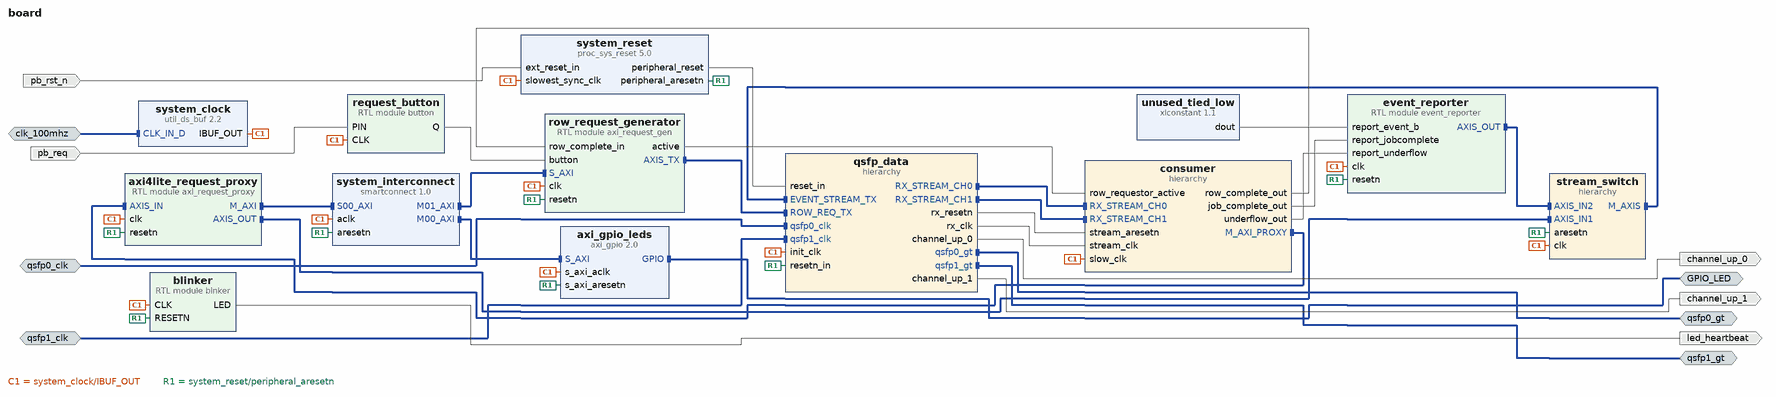
[diagram p0: block diagram of the top level]
# Vivado block design board, xczu19eg-ffvc1760-2-i, Vivado 2021.1
create_bd_design board

create_bd_intf_port -mode Slave -vlnv xilinx.com:interface:diff_clock_rtl:1.0 clk_100mhz
create_bd_intf_port -mode Slave -vlnv xilinx.com:interface:diff_clock_rtl:1.0 qsfp1_clk
set_property -dict {CONFIG.FREQ_HZ 322265625} [get_bd_intf_ports qsfp1_clk]
create_bd_intf_port -mode Slave -vlnv xilinx.com:interface:diff_clock_rtl:1.0 qsfp0_clk
set_property -dict {CONFIG.FREQ_HZ 322265625} [get_bd_intf_ports qsfp0_clk]
create_bd_intf_port -mode Master -vlnv xilinx.com:interface:gpio_rtl:1.0 GPIO_LED
create_bd_intf_port -mode Master -vlnv xilinx.com:interface:gt_rtl:1.0 qsfp0_gt
create_bd_intf_port -mode Master -vlnv xilinx.com:interface:gt_rtl:1.0 qsfp1_gt
create_bd_port -dir O led_heartbeat
create_bd_port -dir I -type rst pb_rst_n
create_bd_port -dir I pb_req
create_bd_port -dir O channel_up_1
create_bd_port -dir O channel_up_0

create_bd_cell -type ip -vlnv xilinx.com:ip:util_ds_buf:2.2 system_clock
create_bd_cell -type ip -vlnv xilinx.com:ip:proc_sys_reset:5.0 system_reset
set_property -dict {CONFIG.C_AUX_RESET_HIGH 0} [get_bd_cells system_reset]
create_bd_cell -type module -reference binker blinker
create_bd_cell -type hier qsfp_data
create_bd_cell -type module -reference button request_button
set_property -dict {CONFIG.ACTIVE_STATE 0 CONFIG.CLOCKS_PER_USEC 400} [get_bd_cells request_button]
create_bd_cell -type hier consumer
create_bd_cell -type ip -vlnv xilinx.com:ip:axi_gpio:2.0 axi_gpio_leds
set_property -dict {CONFIG.C_ALL_OUTPUTS 1 CONFIG.C_GPIO_WIDTH 4} [get_bd_cells axi_gpio_leds]
create_bd_cell -type ip -vlnv xilinx.com:ip:smartconnect:1.0 system_interconnect
set_property -dict {CONFIG.NUM_MI 3 CONFIG.NUM_SI 1} [get_bd_cells system_interconnect]
create_bd_cell -type hier stream_switch
create_bd_cell -type ip -vlnv xilinx.com:ip:xlconstant:1.1 unused_tied_low
set_property -dict {CONFIG.CONST_VAL 0} [get_bd_cells unused_tied_low]
create_bd_cell -type module -reference event_reporter event_reporter
create_bd_cell -type module -reference axi_request_gen row_request_generator
create_bd_cell -type module -reference axi_request_proxy axi4lite_request_proxy

# ---- hierarchy /qsfp_data ----
current_bd_instance /qsfp_data
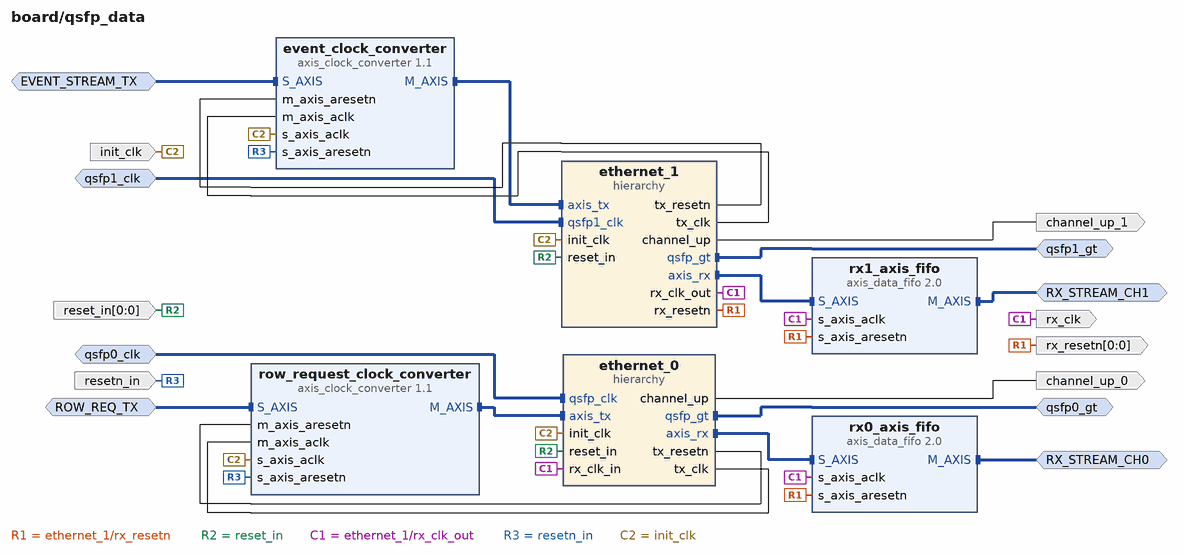
[diagram p1: block diagram inside /qsfp_data]
create_bd_intf_pin -mode Slave -vlnv xilinx.com:interface:axis_rtl:1.0 ROW_REQ_TX
create_bd_intf_pin -mode Slave -vlnv xilinx.com:interface:diff_clock_rtl:1.0 qsfp0_clk
create_bd_intf_pin -mode Slave -vlnv xilinx.com:interface:diff_clock_rtl:1.0 qsfp1_clk
create_bd_intf_pin -mode Slave -vlnv xilinx.com:interface:axis_rtl:1.0 EVENT_STREAM_TX
create_bd_intf_pin -mode Master -vlnv xilinx.com:interface:gt_rtl:1.0 qsfp0_gt
create_bd_intf_pin -mode Master -vlnv xilinx.com:interface:gt_rtl:1.0 qsfp1_gt
create_bd_intf_pin -mode Master -vlnv xilinx.com:interface:axis_rtl:1.0 RX_STREAM_CH0
create_bd_intf_pin -mode Master -vlnv xilinx.com:interface:axis_rtl:1.0 RX_STREAM_CH1
create_bd_pin -dir O channel_up_0
create_bd_pin -dir I -type clk init_clk
create_bd_pin -dir O -type clk rx_clk
create_bd_pin -dir O -from 0 -to 0 rx_resetn
create_bd_pin -dir O channel_up_1
create_bd_pin -dir I resetn_in
create_bd_pin -dir I -from 0 -to 0 reset_in

create_bd_cell -type ip -vlnv xilinx.com:ip:axis_data_fifo:2.0 rx0_axis_fifo
create_bd_cell -type ip -vlnv xilinx.com:ip:axis_data_fifo:2.0 rx1_axis_fifo
set_property -dict {CONFIG.IS_ACLK_ASYNC 0} [get_bd_cells rx1_axis_fifo]
create_bd_cell -type ip -vlnv xilinx.com:ip:axis_clock_converter:1.1 event_clock_converter
create_bd_cell -type ip -vlnv xilinx.com:ip:axis_clock_converter:1.1 row_request_clock_converter
create_bd_cell -type hier ethernet_1
create_bd_cell -type hier ethernet_0

# ---- hierarchy /qsfp_data/ethernet_1 ----
current_bd_instance /qsfp_data/ethernet_1
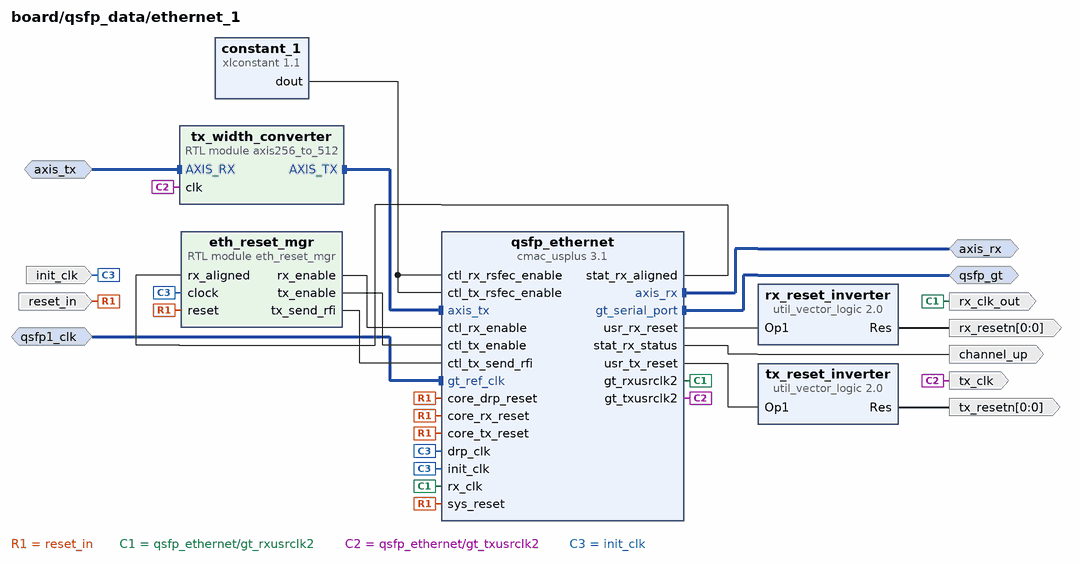
[diagram p2: block diagram inside /qsfp_data/ethernet_1]
create_bd_intf_pin -mode Master -vlnv xilinx.com:interface:gt_rtl:1.0 qsfp_gt
create_bd_intf_pin -mode Slave -vlnv xilinx.com:interface:diff_clock_rtl:1.0 qsfp1_clk
create_bd_intf_pin -mode Master -vlnv xilinx.com:interface:axis_rtl:1.0 axis_rx
create_bd_intf_pin -mode Slave -vlnv xilinx.com:interface:axis_rtl:1.0 axis_tx
create_bd_pin -dir O -type clk tx_clk
create_bd_pin -dir I reset_in
create_bd_pin -dir I -type clk init_clk
create_bd_pin -dir O -type clk rx_clk_out
create_bd_pin -dir O channel_up
create_bd_pin -dir O -from 0 -to 0 rx_resetn
create_bd_pin -dir O -from 0 -to 0 tx_resetn

create_bd_cell -type ip -vlnv xilinx.com:ip:cmac_usplus:3.1 qsfp_ethernet
set_property -dict [list \
  CONFIG.CMAC_CAUI4_MODE 1 \
  CONFIG.CMAC_CORE_SELECT CMACE4_X0Y2 \
  CONFIG.ENABLE_AXI_INTERFACE 0 \
  CONFIG.GT_GROUP_SELECT {X0Y16~X0Y19} \
  CONFIG.GT_REF_CLK_FREQ 322.265625 \
  CONFIG.INCLUDE_RS_FEC 1 \
  CONFIG.INS_LOSS_NYQ 20 \
  CONFIG.NUM_LANES 4x25 \
  CONFIG.RX_FLOW_CONTROL 0 \
  CONFIG.TX_FLOW_CONTROL 0 \
  CONFIG.USER_INTERFACE AXIS \
] [get_bd_cells qsfp_ethernet]
create_bd_cell -type ip -vlnv xilinx.com:ip:util_vector_logic:2.0 rx_reset_inverter
set_property -dict {CONFIG.C_OPERATION not CONFIG.C_SIZE 1} [get_bd_cells rx_reset_inverter]
create_bd_cell -type module -reference axis256_to_512 tx_width_converter
create_bd_cell -type module -reference eth_reset_mgr eth_reset_mgr
create_bd_cell -type ip -vlnv xilinx.com:ip:util_vector_logic:2.0 tx_reset_inverter
set_property -dict {CONFIG.C_OPERATION not CONFIG.C_SIZE 1} [get_bd_cells tx_reset_inverter]
create_bd_cell -type ip -vlnv xilinx.com:ip:xlconstant:1.1 constant_1

# ---- hierarchy /qsfp_data/ethernet_0 ----
current_bd_instance /qsfp_data/ethernet_0
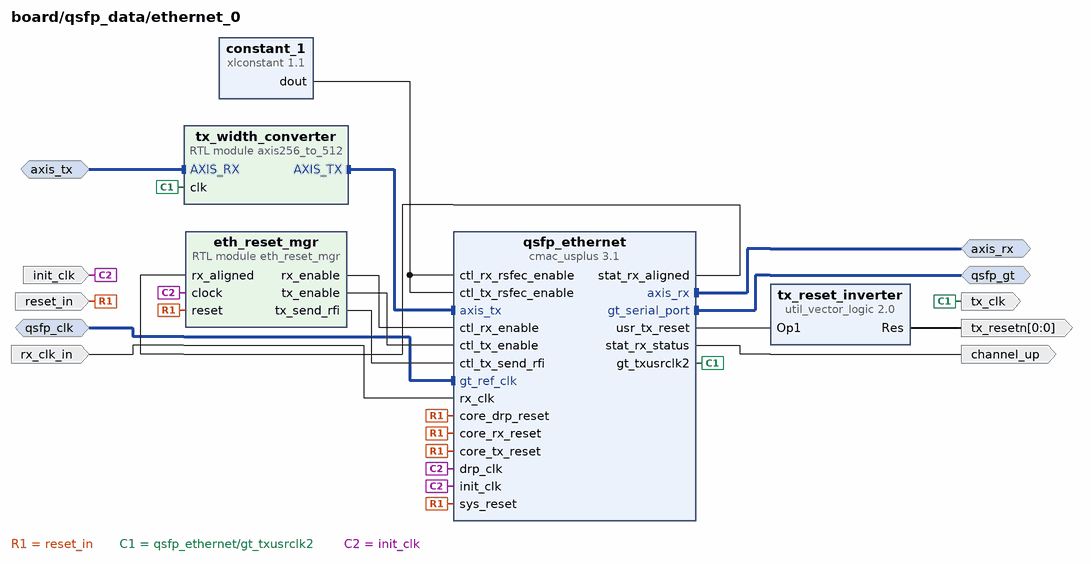
[diagram p3: block diagram inside /qsfp_data/ethernet_0]
create_bd_intf_pin -mode Master -vlnv xilinx.com:interface:gt_rtl:1.0 qsfp_gt
create_bd_intf_pin -mode Slave -vlnv xilinx.com:interface:diff_clock_rtl:1.0 qsfp_clk
create_bd_intf_pin -mode Master -vlnv xilinx.com:interface:axis_rtl:1.0 axis_rx
create_bd_intf_pin -mode Slave -vlnv xilinx.com:interface:axis_rtl:1.0 axis_tx
create_bd_pin -dir O -type clk tx_clk
create_bd_pin -dir I reset_in
create_bd_pin -dir I -type clk init_clk
create_bd_pin -dir O channel_up
create_bd_pin -dir O -from 0 -to 0 tx_resetn
create_bd_pin -dir I -type clk rx_clk_in

create_bd_cell -type ip -vlnv xilinx.com:ip:cmac_usplus:3.1 qsfp_ethernet
set_property -dict [list \
  CONFIG.CMAC_CAUI4_MODE 1 \
  CONFIG.CMAC_CORE_SELECT CMACE4_X0Y1 \
  CONFIG.GT_GROUP_SELECT {X0Y12~X0Y15} \
  CONFIG.GT_REF_CLK_FREQ 322.265625 \
  CONFIG.INCLUDE_RS_FEC 1 \
  CONFIG.INS_LOSS_NYQ 20 \
  CONFIG.NUM_LANES 4x25 \
  CONFIG.RX_FLOW_CONTROL 0 \
  CONFIG.TX_FLOW_CONTROL 0 \
  CONFIG.USER_INTERFACE AXIS \
] [get_bd_cells qsfp_ethernet]
create_bd_cell -type module -reference axis256_to_512 tx_width_converter
create_bd_cell -type module -reference eth_reset_mgr eth_reset_mgr
create_bd_cell -type ip -vlnv xilinx.com:ip:util_vector_logic:2.0 tx_reset_inverter
set_property -dict {CONFIG.C_OPERATION not CONFIG.C_SIZE 1} [get_bd_cells tx_reset_inverter]
create_bd_cell -type ip -vlnv xilinx.com:ip:xlconstant:1.1 constant_1

# ---- hierarchy /consumer ----
current_bd_instance /consumer
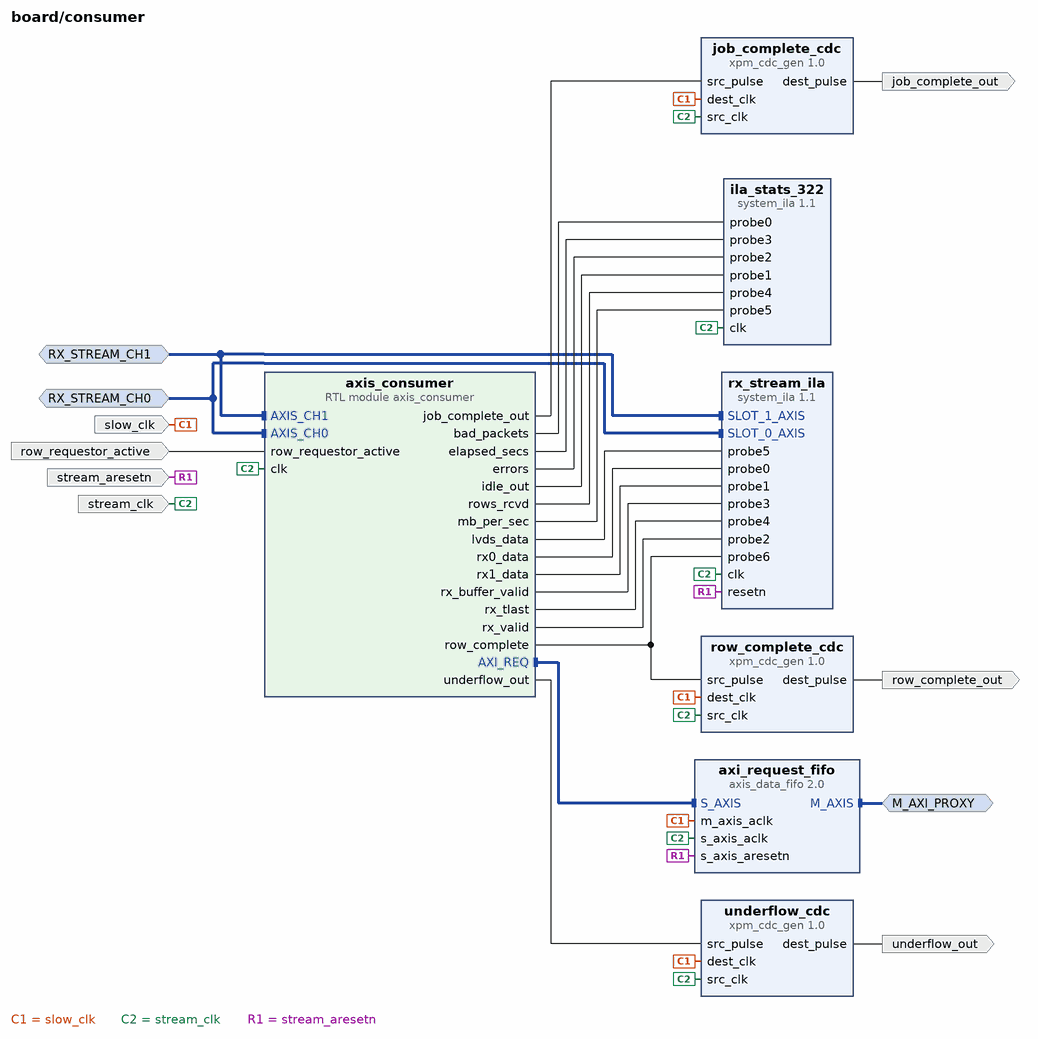
[diagram p4: block diagram inside /consumer]
create_bd_intf_pin -mode Master -vlnv xilinx.com:interface:axis_rtl:1.0 M_AXI_PROXY
create_bd_intf_pin -mode Slave -vlnv xilinx.com:interface:axis_rtl:1.0 RX_STREAM_CH0
create_bd_intf_pin -mode Slave -vlnv xilinx.com:interface:axis_rtl:1.0 RX_STREAM_CH1
create_bd_pin -dir I -type clk stream_clk
create_bd_pin -dir I -type clk slow_clk
create_bd_pin -dir O row_complete_out
create_bd_pin -dir I -type rst stream_aresetn
create_bd_pin -dir I row_requestor_active
create_bd_pin -dir O underflow_out
create_bd_pin -dir O job_complete_out

create_bd_cell -type ip -vlnv xilinx.com:ip:xpm_cdc_gen:1.0 row_complete_cdc
set_property -dict [list \
  CONFIG.CDC_TYPE xpm_cdc_pulse \
  CONFIG.RST_USED false \
  CONFIG.SIM_ASSERT_CHK false \
] [get_bd_cells row_complete_cdc]
create_bd_cell -type ip -vlnv xilinx.com:ip:axis_data_fifo:2.0 axi_request_fifo
set_property -dict {CONFIG.FIFO_DEPTH 16 CONFIG.IS_ACLK_ASYNC 1} [get_bd_cells axi_request_fifo]
create_bd_cell -type ip -vlnv xilinx.com:ip:xpm_cdc_gen:1.0 underflow_cdc
set_property -dict {CONFIG.CDC_TYPE xpm_cdc_pulse CONFIG.RST_USED false CONFIG.SIM_ASSERT_CHK false} [get_bd_cells underflow_cdc]
create_bd_cell -type ip -vlnv xilinx.com:ip:xpm_cdc_gen:1.0 job_complete_cdc
set_property -dict [list \
  CONFIG.CDC_TYPE xpm_cdc_pulse \
  CONFIG.RST_USED false \
  CONFIG.SIM_ASSERT_CHK false \
] [get_bd_cells job_complete_cdc]
create_bd_cell -type ip -vlnv xilinx.com:ip:system_ila:1.1 rx_stream_ila
set_property -dict [list \
  CONFIG.C_MON_TYPE MIX \
  CONFIG.C_NUM_MONITOR_SLOTS 2 \
  CONFIG.C_NUM_OF_PROBES 7 \
  CONFIG.C_SLOT 1 \
  CONFIG.C_SLOT_0_INTF_TYPE xilinx.com:interface:axis_rtl:1.0 \
  CONFIG.C_SLOT_1_INTF_TYPE xilinx.com:interface:axis_rtl:1.0 \
] [get_bd_cells rx_stream_ila]
create_bd_cell -type ip -vlnv xilinx.com:ip:system_ila:1.1 ila_stats_322
set_property -dict {CONFIG.C_MON_TYPE NATIVE CONFIG.C_NUM_OF_PROBES 6} [get_bd_cells ila_stats_322]
create_bd_cell -type module -reference axis_consumer axis_consumer

# ---- hierarchy /stream_switch ----
current_bd_instance /stream_switch
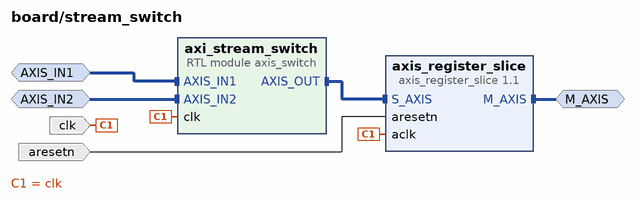
[diagram p5: block diagram inside /stream_switch]
create_bd_intf_pin -mode Slave -vlnv xilinx.com:interface:axis_rtl:1.0 AXIS_IN1
create_bd_intf_pin -mode Slave -vlnv xilinx.com:interface:axis_rtl:1.0 AXIS_IN2
create_bd_intf_pin -mode Master -vlnv xilinx.com:interface:axis_rtl:1.0 M_AXIS
create_bd_pin -dir I -type clk clk
create_bd_pin -dir I -type rst aresetn

create_bd_cell -type module -reference axis_switch axi_stream_switch
create_bd_cell -type ip -vlnv xilinx.com:ip:axis_register_slice:1.1 axis_register_slice

# ---- connections ----

current_bd_instance /qsfp_data
connect_bd_intf_net [get_bd_intf_pins qsfp1_gt] [get_bd_intf_pins ethernet_1/qsfp_gt]
connect_bd_intf_net [get_bd_intf_pins qsfp0_gt] [get_bd_intf_pins ethernet_0/qsfp_gt]
connect_bd_intf_net [get_bd_intf_pins EVENT_STREAM_TX] [get_bd_intf_pins event_clock_converter/S_AXIS]
connect_bd_intf_net [get_bd_intf_pins ROW_REQ_TX] [get_bd_intf_pins row_request_clock_converter/S_AXIS]
connect_bd_intf_net [get_bd_intf_pins event_clock_converter/M_AXIS] [get_bd_intf_pins ethernet_1/axis_tx]
connect_bd_intf_net [get_bd_intf_pins qsfp0_clk] [get_bd_intf_pins ethernet_0/qsfp_clk]
connect_bd_intf_net [get_bd_intf_pins ethernet_0/axis_rx] [get_bd_intf_pins rx0_axis_fifo/S_AXIS]
connect_bd_intf_net [get_bd_intf_pins qsfp1_clk] [get_bd_intf_pins ethernet_1/qsfp1_clk]
connect_bd_intf_net [get_bd_intf_pins rx1_axis_fifo/S_AXIS] [get_bd_intf_pins ethernet_1/axis_rx]
connect_bd_intf_net [get_bd_intf_pins row_request_clock_converter/M_AXIS] [get_bd_intf_pins ethernet_0/axis_tx]
connect_bd_intf_net [get_bd_intf_pins RX_STREAM_CH0] [get_bd_intf_pins rx0_axis_fifo/M_AXIS]
connect_bd_intf_net [get_bd_intf_pins RX_STREAM_CH1] [get_bd_intf_pins rx1_axis_fifo/M_AXIS]
connect_bd_net -net ethernet_0_Res [get_bd_pins ethernet_0/tx_resetn] [get_bd_pins row_request_clock_converter/m_axis_aresetn]
connect_bd_net -net ethernet_1_Res [get_bd_pins ethernet_1/rx_resetn] \
  [get_bd_pins rx1_axis_fifo/s_axis_aresetn] [get_bd_pins rx0_axis_fifo/s_axis_aresetn] [get_bd_pins rx_resetn]
connect_bd_net -net ethernet_1_Res1 [get_bd_pins ethernet_1/tx_resetn] [get_bd_pins event_clock_converter/m_axis_aresetn]
connect_bd_net -net master_reset_Res [get_bd_pins reset_in] [get_bd_pins ethernet_1/reset_in] [get_bd_pins ethernet_0/reset_in]
connect_bd_net -net qsfp0_ethernet_gt_txusrclk2 [get_bd_pins ethernet_0/tx_clk] [get_bd_pins row_request_clock_converter/m_axis_aclk]
connect_bd_net -net qsfp0_ethernet_stat_rx_status [get_bd_pins ethernet_0/channel_up] [get_bd_pins channel_up_0]
connect_bd_net -net qsfp1_ethernet_gt_rxusrclk2 [get_bd_pins ethernet_1/rx_clk_out] \
  [get_bd_pins rx1_axis_fifo/s_axis_aclk] [get_bd_pins ethernet_0/rx_clk_in] [get_bd_pins rx_clk] \
  [get_bd_pins rx0_axis_fifo/s_axis_aclk]
connect_bd_net -net qsfp1_ethernet_gt_txusrclk2 [get_bd_pins ethernet_1/tx_clk] [get_bd_pins event_clock_converter/m_axis_aclk]
connect_bd_net -net qsfp1_ethernet_stat_rx_status [get_bd_pins ethernet_1/channel_up] [get_bd_pins channel_up_1]
connect_bd_net [get_bd_pins resetn_in] [get_bd_pins event_clock_converter/s_axis_aresetn] [get_bd_pins row_request_clock_converter/s_axis_aresetn]
connect_bd_net -net system_clock_IBUF_OUT [get_bd_pins init_clk] \
  [get_bd_pins event_clock_converter/s_axis_aclk] [get_bd_pins row_request_clock_converter/s_axis_aclk] \
  [get_bd_pins ethernet_1/init_clk] [get_bd_pins ethernet_0/init_clk]

current_bd_instance /qsfp_data/ethernet_1
connect_bd_intf_net [get_bd_intf_pins qsfp_gt] [get_bd_intf_pins qsfp_ethernet/gt_serial_port]
connect_bd_intf_net [get_bd_intf_pins axis_tx] [get_bd_intf_pins tx_width_converter/AXIS_RX]
connect_bd_intf_net [get_bd_intf_pins qsfp1_clk] [get_bd_intf_pins qsfp_ethernet/gt_ref_clk]
connect_bd_intf_net [get_bd_intf_pins axis_rx] [get_bd_intf_pins qsfp_ethernet/axis_rx]
connect_bd_intf_net [get_bd_intf_pins qsfp_ethernet/axis_tx] [get_bd_intf_pins tx_width_converter/AXIS_TX]
connect_bd_net [get_bd_pins constant_1/dout] [get_bd_pins qsfp_ethernet/ctl_rx_rsfec_enable] [get_bd_pins qsfp_ethernet/ctl_tx_rsfec_enable]
connect_bd_net -net eth_reset_mgr_0_rx_enable [get_bd_pins eth_reset_mgr/rx_enable] [get_bd_pins qsfp_ethernet/ctl_rx_enable]
connect_bd_net -net eth_reset_mgr_0_tx_enable [get_bd_pins eth_reset_mgr/tx_enable] [get_bd_pins qsfp_ethernet/ctl_tx_enable]
connect_bd_net -net eth_reset_mgr_0_tx_send_rfi [get_bd_pins eth_reset_mgr/tx_send_rfi] [get_bd_pins qsfp_ethernet/ctl_tx_send_rfi]
connect_bd_net -net master_reset_Res [get_bd_pins reset_in] \
  [get_bd_pins qsfp_ethernet/core_rx_reset] [get_bd_pins qsfp_ethernet/core_tx_reset] \
  [get_bd_pins qsfp_ethernet/core_drp_reset] [get_bd_pins qsfp_ethernet/sys_reset] [get_bd_pins eth_reset_mgr/reset]
connect_bd_net -net qsfp1_ethernet_gt_rxusrclk2 [get_bd_pins qsfp_ethernet/gt_rxusrclk2] [get_bd_pins rx_clk_out] [get_bd_pins qsfp_ethernet/rx_clk]
connect_bd_net -net qsfp1_ethernet_gt_txusrclk2 [get_bd_pins qsfp_ethernet/gt_txusrclk2] [get_bd_pins tx_clk] [get_bd_pins tx_width_converter/clk]
connect_bd_net -net qsfp1_ethernet_stat_rx_aligned [get_bd_pins qsfp_ethernet/stat_rx_aligned] [get_bd_pins eth_reset_mgr/rx_aligned]
connect_bd_net -net qsfp1_ethernet_stat_rx_status [get_bd_pins qsfp_ethernet/stat_rx_status] [get_bd_pins channel_up]
connect_bd_net -net qsfp1_ethernet_usr_rx_reset [get_bd_pins qsfp_ethernet/usr_rx_reset] [get_bd_pins rx_reset_inverter/Op1]
connect_bd_net -net qsfp1_ethernet_usr_tx_reset [get_bd_pins qsfp_ethernet/usr_tx_reset] [get_bd_pins tx_reset_inverter/Op1]
connect_bd_net -net rx1_reset_inverter_Res [get_bd_pins rx_reset_inverter/Res] [get_bd_pins rx_resetn]
connect_bd_net -net system_clock_IBUF_OUT [get_bd_pins init_clk] \
  [get_bd_pins qsfp_ethernet/drp_clk] [get_bd_pins qsfp_ethernet/init_clk] [get_bd_pins eth_reset_mgr/clock]
connect_bd_net -net tx1_reset_inverter_Res [get_bd_pins tx_reset_inverter/Res] [get_bd_pins tx_resetn]

current_bd_instance /qsfp_data/ethernet_0
connect_bd_intf_net [get_bd_intf_pins axis_tx] [get_bd_intf_pins tx_width_converter/AXIS_RX]
connect_bd_intf_net [get_bd_intf_pins qsfp_gt] [get_bd_intf_pins qsfp_ethernet/gt_serial_port]
connect_bd_intf_net [get_bd_intf_pins qsfp_clk] [get_bd_intf_pins qsfp_ethernet/gt_ref_clk]
connect_bd_intf_net [get_bd_intf_pins axis_rx] [get_bd_intf_pins qsfp_ethernet/axis_rx]
connect_bd_intf_net [get_bd_intf_pins qsfp_ethernet/axis_tx] [get_bd_intf_pins tx_width_converter/AXIS_TX]
connect_bd_net [get_bd_pins constant_1/dout] [get_bd_pins qsfp_ethernet/ctl_rx_rsfec_enable] [get_bd_pins qsfp_ethernet/ctl_tx_rsfec_enable]
connect_bd_net -net eth_reset_mgr_0_rx_enable [get_bd_pins eth_reset_mgr/rx_enable] [get_bd_pins qsfp_ethernet/ctl_rx_enable]
connect_bd_net -net eth_reset_mgr_0_tx_enable [get_bd_pins eth_reset_mgr/tx_enable] [get_bd_pins qsfp_ethernet/ctl_tx_enable]
connect_bd_net -net eth_reset_mgr_0_tx_send_rfi [get_bd_pins eth_reset_mgr/tx_send_rfi] [get_bd_pins qsfp_ethernet/ctl_tx_send_rfi]
connect_bd_net -net master_reset_Res [get_bd_pins reset_in] \
  [get_bd_pins qsfp_ethernet/core_tx_reset] [get_bd_pins qsfp_ethernet/core_rx_reset] \
  [get_bd_pins qsfp_ethernet/core_drp_reset] [get_bd_pins qsfp_ethernet/sys_reset] [get_bd_pins eth_reset_mgr/reset]
connect_bd_net -net qsfp0_ethernet_gt_txusrclk2 [get_bd_pins qsfp_ethernet/gt_txusrclk2] [get_bd_pins tx_clk] [get_bd_pins tx_width_converter/clk]
connect_bd_net -net qsfp0_ethernet_stat_rx_aligned [get_bd_pins qsfp_ethernet/stat_rx_aligned] [get_bd_pins eth_reset_mgr/rx_aligned]
connect_bd_net -net qsfp0_ethernet_stat_rx_status [get_bd_pins qsfp_ethernet/stat_rx_status] [get_bd_pins channel_up]
connect_bd_net -net qsfp0_ethernet_usr_tx_reset [get_bd_pins qsfp_ethernet/usr_tx_reset] [get_bd_pins tx_reset_inverter/Op1]
connect_bd_net -net rx_clk1_1 [get_bd_pins rx_clk_in] [get_bd_pins qsfp_ethernet/rx_clk]
connect_bd_net -net system_clock_IBUF_OUT [get_bd_pins init_clk] \
  [get_bd_pins qsfp_ethernet/drp_clk] [get_bd_pins qsfp_ethernet/init_clk] [get_bd_pins eth_reset_mgr/clock]
connect_bd_net -net tx0_reset_inverter_Res [get_bd_pins tx_reset_inverter/Res] [get_bd_pins tx_resetn]

current_bd_instance /consumer
connect_bd_intf_net [get_bd_intf_pins RX_STREAM_CH1] [get_bd_intf_pins axis_consumer/AXIS_CH1]
connect_bd_intf_net [get_bd_intf_pins RX_STREAM_CH1] [get_bd_intf_pins rx_stream_ila/SLOT_1_AXIS]
connect_bd_intf_net [get_bd_intf_pins M_AXI_PROXY] [get_bd_intf_pins axi_request_fifo/M_AXIS]
connect_bd_intf_net [get_bd_intf_pins RX_STREAM_CH0] [get_bd_intf_pins axis_consumer/AXIS_CH0]
connect_bd_intf_net [get_bd_intf_pins RX_STREAM_CH0] [get_bd_intf_pins rx_stream_ila/SLOT_0_AXIS]
connect_bd_intf_net [get_bd_intf_pins axi_request_fifo/S_AXIS] [get_bd_intf_pins axis_consumer/AXI_REQ]
connect_bd_net [get_bd_pins axis_consumer/bad_packets] [get_bd_pins ila_stats_322/probe0]
connect_bd_net [get_bd_pins axis_consumer/elapsed_secs] [get_bd_pins ila_stats_322/probe3]
connect_bd_net [get_bd_pins axis_consumer/errors] [get_bd_pins ila_stats_322/probe2]
connect_bd_net [get_bd_pins axis_consumer/idle_out] [get_bd_pins ila_stats_322/probe1]
connect_bd_net [get_bd_pins axis_consumer/job_complete_out] [get_bd_pins job_complete_cdc/src_pulse]
connect_bd_net [get_bd_pins axis_consumer/lvds_data] [get_bd_pins rx_stream_ila/probe5]
connect_bd_net [get_bd_pins axis_consumer/rows_rcvd] [get_bd_pins ila_stats_322/probe4]
connect_bd_net [get_bd_pins axis_consumer/rx0_data] [get_bd_pins rx_stream_ila/probe0]
connect_bd_net [get_bd_pins axis_consumer/rx1_data] [get_bd_pins rx_stream_ila/probe1]
connect_bd_net [get_bd_pins axis_consumer/rx_buffer_valid] [get_bd_pins rx_stream_ila/probe3]
connect_bd_net [get_bd_pins axis_consumer/rx_tlast] [get_bd_pins rx_stream_ila/probe4]
connect_bd_net [get_bd_pins axis_consumer/rx_valid] [get_bd_pins rx_stream_ila/probe2]
connect_bd_net [get_bd_pins axis_consumer/underflow_out] [get_bd_pins underflow_cdc/src_pulse]
connect_bd_net -net dest_clk_1 [get_bd_pins slow_clk] \
  [get_bd_pins row_complete_cdc/dest_clk] [get_bd_pins axi_request_fifo/m_axis_aclk] [get_bd_pins underflow_cdc/dest_clk] \
  [get_bd_pins job_complete_cdc/dest_clk]
connect_bd_net [get_bd_pins job_complete_cdc/dest_pulse] [get_bd_pins job_complete_out]
connect_bd_net -net mb_per_sec [get_bd_pins axis_consumer/mb_per_sec] [get_bd_pins ila_stats_322/probe5]
connect_bd_net -net qsfp_data_user_clk_out [get_bd_pins stream_clk] \
  [get_bd_pins row_complete_cdc/src_clk] [get_bd_pins axi_request_fifo/s_axis_aclk] [get_bd_pins underflow_cdc/src_clk] \
  [get_bd_pins job_complete_cdc/src_clk] [get_bd_pins rx_stream_ila/clk] [get_bd_pins ila_stats_322/clk] \
  [get_bd_pins axis_consumer/clk]
connect_bd_net -net row_complete [get_bd_pins axis_consumer/row_complete] [get_bd_pins row_complete_cdc/src_pulse] [get_bd_pins rx_stream_ila/probe6]
connect_bd_net [get_bd_pins row_complete_cdc/dest_pulse] [get_bd_pins row_complete_out]
connect_bd_net -net row_requestor_idle_1 [get_bd_pins row_requestor_active] [get_bd_pins axis_consumer/row_requestor_active]
connect_bd_net -net s_axis_aresetn_1 [get_bd_pins stream_aresetn] [get_bd_pins axi_request_fifo/s_axis_aresetn] [get_bd_pins rx_stream_ila/resetn]
connect_bd_net [get_bd_pins underflow_cdc/dest_pulse] [get_bd_pins underflow_out]

current_bd_instance /stream_switch
connect_bd_intf_net [get_bd_intf_pins M_AXIS] [get_bd_intf_pins axis_register_slice/M_AXIS]
connect_bd_intf_net [get_bd_intf_pins AXIS_IN1] [get_bd_intf_pins axi_stream_switch/AXIS_IN1]
connect_bd_intf_net [get_bd_intf_pins axi_stream_switch/AXIS_OUT] [get_bd_intf_pins axis_register_slice/S_AXIS]
connect_bd_intf_net [get_bd_intf_pins AXIS_IN2] [get_bd_intf_pins axi_stream_switch/AXIS_IN2]
connect_bd_net [get_bd_pins aresetn] [get_bd_pins axis_register_slice/aresetn]
connect_bd_net -net system_clock_IBUF_OUT [get_bd_pins clk] [get_bd_pins axi_stream_switch/clk] [get_bd_pins axis_register_slice/aclk]

current_bd_instance /
connect_bd_intf_net [get_bd_intf_ports clk_100mhz] [get_bd_intf_pins system_clock/CLK_IN_D]
connect_bd_intf_net [get_bd_intf_pins qsfp_data/EVENT_STREAM_TX] [get_bd_intf_pins stream_switch/M_AXIS]
connect_bd_intf_net [get_bd_intf_ports qsfp0_clk] [get_bd_intf_pins qsfp_data/qsfp0_clk]
connect_bd_intf_net [get_bd_intf_ports GPIO_LED] [get_bd_intf_pins axi_gpio_leds/GPIO]
connect_bd_intf_net [get_bd_intf_pins axi4lite_request_proxy/AXIS_OUT] [get_bd_intf_pins stream_switch/AXIS_IN1]
connect_bd_intf_net [get_bd_intf_pins system_interconnect/S00_AXI] [get_bd_intf_pins axi4lite_request_proxy/M_AXI]
connect_bd_intf_net [get_bd_intf_pins axi4lite_request_proxy/AXIS_IN] [get_bd_intf_pins consumer/M_AXI_PROXY]
connect_bd_intf_net [get_bd_intf_pins event_reporter/AXIS_OUT] [get_bd_intf_pins stream_switch/AXIS_IN2]
connect_bd_intf_net [get_bd_intf_ports qsfp1_clk] [get_bd_intf_pins qsfp_data/qsfp1_clk]
connect_bd_intf_net [get_bd_intf_pins qsfp_data/RX_STREAM_CH0] [get_bd_intf_pins consumer/RX_STREAM_CH0]
connect_bd_intf_net [get_bd_intf_pins qsfp_data/RX_STREAM_CH1] [get_bd_intf_pins consumer/RX_STREAM_CH1]
connect_bd_intf_net [get_bd_intf_ports qsfp0_gt] [get_bd_intf_pins qsfp_data/qsfp0_gt]
connect_bd_intf_net [get_bd_intf_ports qsfp1_gt] [get_bd_intf_pins qsfp_data/qsfp1_gt]
connect_bd_intf_net [get_bd_intf_pins row_request_generator/AXIS_TX] [get_bd_intf_pins qsfp_data/ROW_REQ_TX]
connect_bd_intf_net [get_bd_intf_pins system_interconnect/M00_AXI] [get_bd_intf_pins axi_gpio_leds/S_AXI]
connect_bd_intf_net [get_bd_intf_pins system_interconnect/M01_AXI] [get_bd_intf_pins row_request_generator/S_AXI]
connect_bd_net -net PIN_0_1 [get_bd_ports pb_req] [get_bd_pins request_button/PIN]
connect_bd_net -net binker_0_LED [get_bd_pins blinker/LED] [get_bd_ports led_heartbeat]
connect_bd_net -net consumer_dest_pulse [get_bd_pins consumer/job_complete_out] [get_bd_pins event_reporter/report_jobcomplete]
connect_bd_net -net consumer_row_complete [get_bd_pins consumer/row_complete_out] [get_bd_pins row_request_generator/row_complete_in]
connect_bd_net [get_bd_pins consumer/underflow_out] [get_bd_pins event_reporter/report_underflow]
connect_bd_net -net ext_reset_in_0_1 [get_bd_ports pb_rst_n] [get_bd_pins system_reset/ext_reset_in]
connect_bd_net [get_bd_pins qsfp_data/channel_up_0] [get_bd_ports channel_up_0]
connect_bd_net [get_bd_pins qsfp_data/channel_up_1] [get_bd_ports channel_up_1]
connect_bd_net -net qsfp_data_sys_resetn_out [get_bd_pins qsfp_data/rx_resetn] [get_bd_pins consumer/stream_aresetn]
connect_bd_net -net qsfp_data_user_clk_out [get_bd_pins qsfp_data/rx_clk] [get_bd_pins consumer/stream_clk]
connect_bd_net [get_bd_pins request_button/Q] [get_bd_pins row_request_generator/button]
connect_bd_net [get_bd_pins row_request_generator/active] [get_bd_pins consumer/row_requestor_active]
connect_bd_net [get_bd_pins system_clock/IBUF_OUT] \
  [get_bd_pins system_reset/slowest_sync_clk] [get_bd_pins blinker/CLK] [get_bd_pins qsfp_data/init_clk] \
  [get_bd_pins request_button/CLK] [get_bd_pins consumer/slow_clk] [get_bd_pins axi_gpio_leds/s_axi_aclk] \
  [get_bd_pins system_interconnect/aclk] [get_bd_pins stream_switch/clk] [get_bd_pins event_reporter/clk] \
  [get_bd_pins row_request_generator/clk] [get_bd_pins axi4lite_request_proxy/clk]
connect_bd_net [get_bd_pins system_reset/peripheral_aresetn] \
  [get_bd_pins blinker/RESETN] [get_bd_pins axi_gpio_leds/s_axi_aresetn] [get_bd_pins system_interconnect/aresetn] \
  [get_bd_pins qsfp_data/resetn_in] [get_bd_pins stream_switch/aresetn] [get_bd_pins event_reporter/resetn] \
  [get_bd_pins row_request_generator/resetn] [get_bd_pins axi4lite_request_proxy/resetn]
connect_bd_net [get_bd_pins system_reset/peripheral_reset] [get_bd_pins qsfp_data/reset_in]
connect_bd_net -net tied_low_dout [get_bd_pins unused_tied_low/dout] [get_bd_pins event_reporter/report_event_b]

# ---- address map ----
assign_bd_address -offset 0x00001000 -range 256 -target_address_space [get_bd_addr_spaces axi4lite_request_proxy/M_AXI] [get_bd_addr_segs axi_gpio_leds/S_AXI/Reg]
assign_bd_address -offset 0x00002000 -range 256 -target_address_space [get_bd_addr_spaces axi4lite_request_proxy/M_AXI] [get_bd_addr_segs row_request_generator/S_AXI/reg0]

validate_bd_design
save_bd_design
